# EAGLE design Nano-RS485_RJ45-GW-v1_7 (EAGLE 7.7.0)
Nano-RS485-RFM69_RJ45-GW
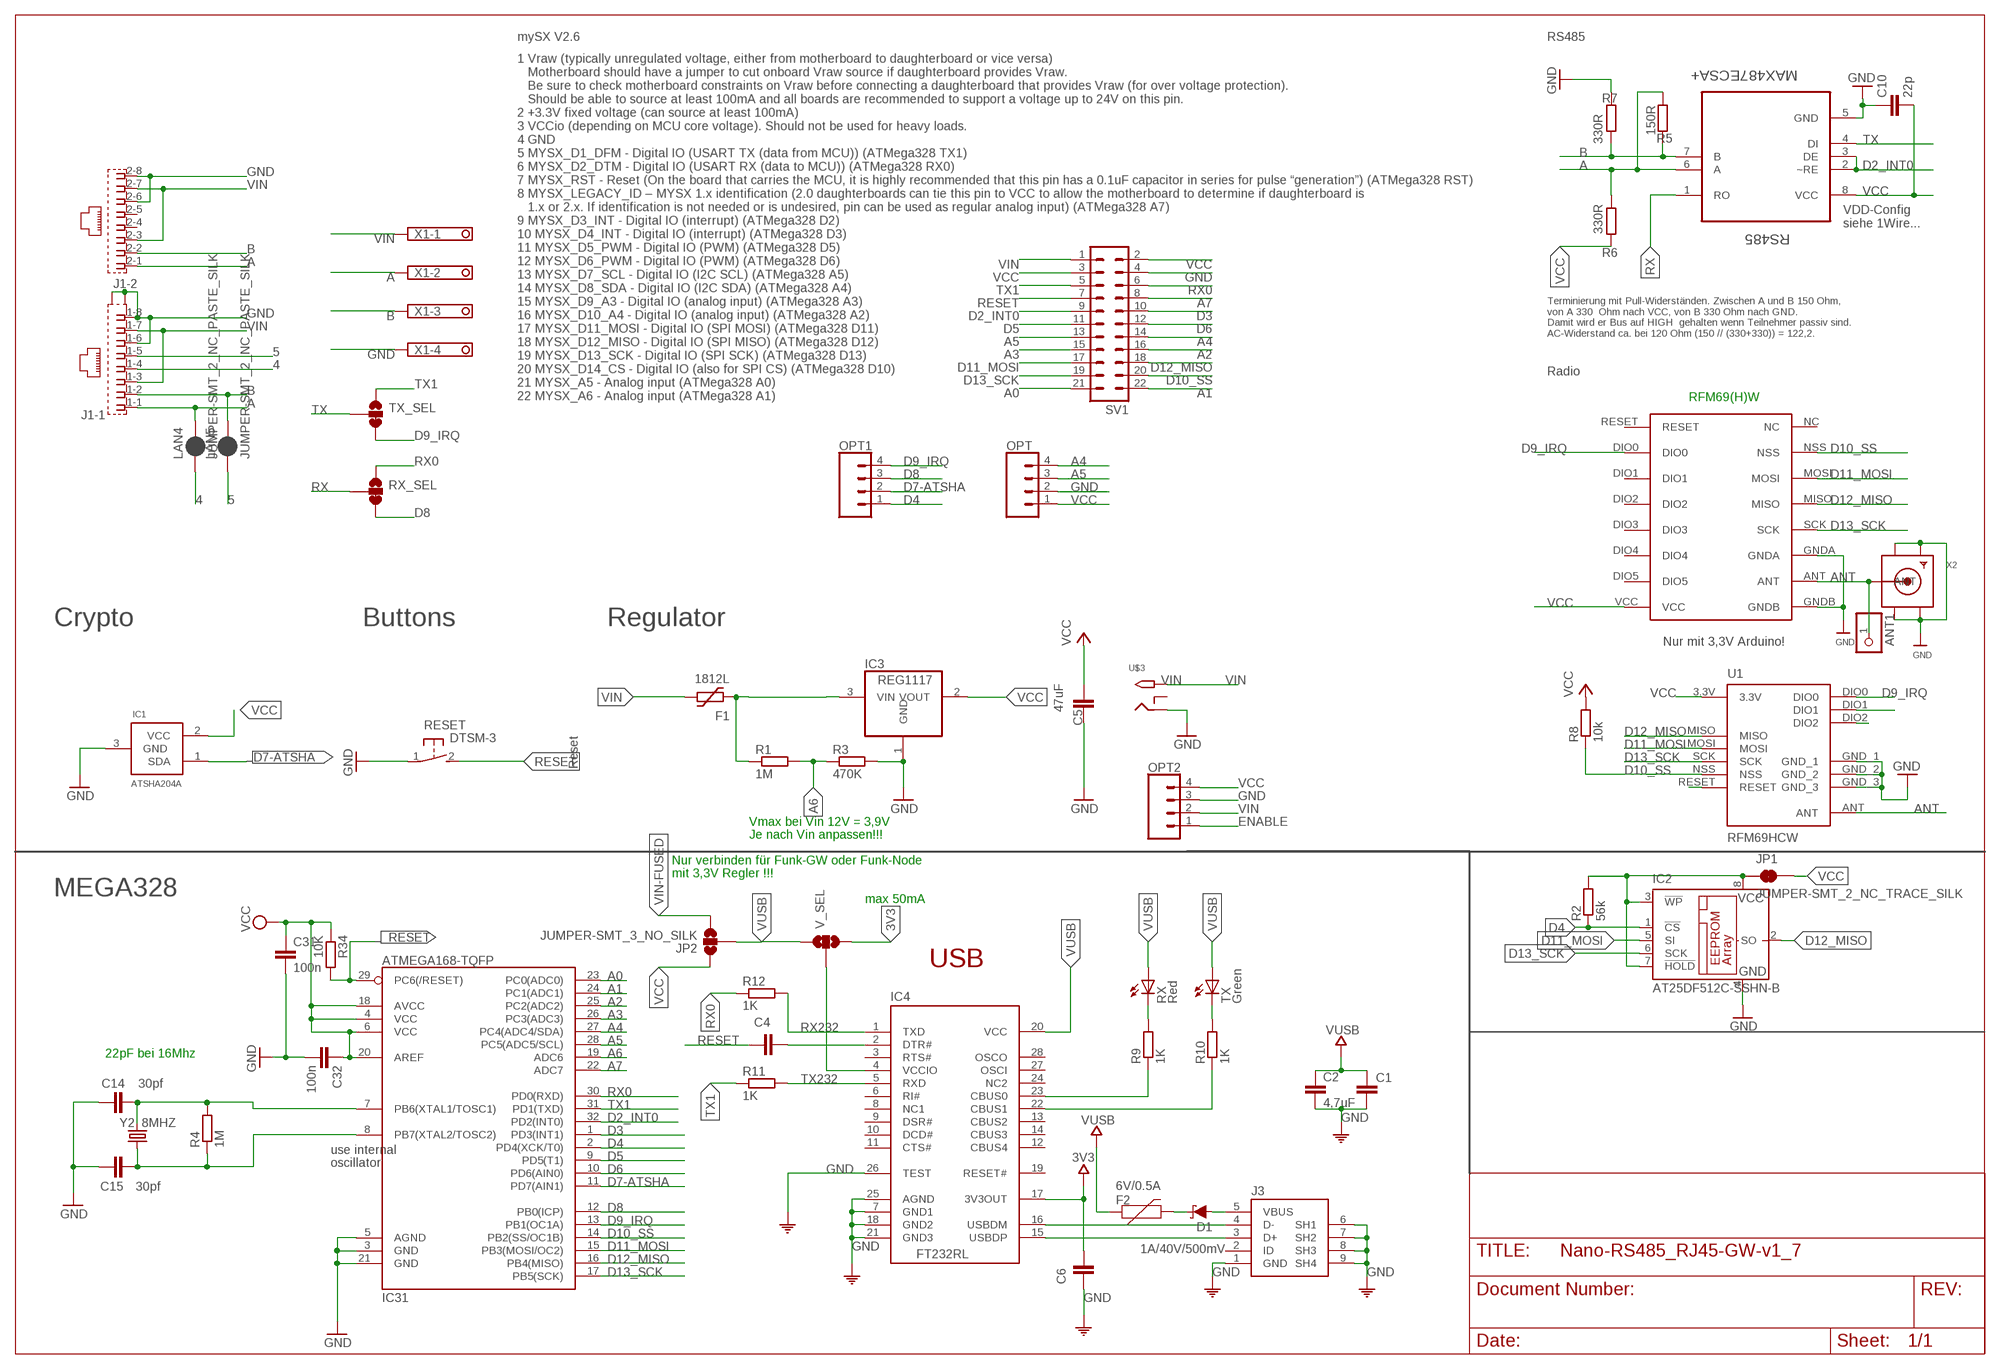
[diagram p0: schematic, sheet 1]

## Parts
ANT1  PINHD-1X1  [1X01]
C1  100nF  C-EUC0805  [C0805]
C2  4,7uF  C-EUC1206  [C1206]
C4  100nF  C-EUC0805  [C0805]
C5  47uF  C-EUC1206  [C1206]
C6  100nF  C-EUC0805  [C0805]
C10  22p  C-EUC0805  [C0805]
C14  30pf  CAP0805  [0805]
C15  30pf  CAP0805  [0805]
C31  100n  C-EUC0805  [C0805]
C32  100n  C-EUC0805  [C0805]
D1  1A/40V/500mV  DIODE-SCHOTTKY-SS14  [SMA-DIODE]
F1  1812L  [1812L]
F2  6V/0.5A  PPTC_HALF-AMP  [1206]
IC1  ATSHA204A  [SOT23]
IC2  AT25DF512C-SSHN-B  25AA080SN  [SO-08]
IC3  REG1117  [SOT223]
IC4  FT232RL  0226_FT232RL  [SSOP28]
IC31  ATMEGA168-TQFP  [TQFP32-08]
J1  RJ45_2X_NARROW_SHILDPINS_NOCASE  [RJ45_2X_NARROW_SHILDPINS_NOCASE]
J3  0219_14850  [USB-MINI-B_2]
JP1  JUMPER-SMT_2_NC_TRACE_SILK  [SMT-JUMPER_2_NC_TRACE_SILK]
JP2  JUMPER-SMT_3_NO_SILK  [SMT-JUMPER_3_NO_SILK]
LAN4  JUMPER-SMT_2_NC_PASTE_SILK  [SMT-JUMPER_2_NC_PASTE_SILK]
LAN5  JUMPER-SMT_2_NC_PASTE_SILK  [SMT-JUMPER_2_NC_PASTE_SILK]
OPT  CONN_04  [1X04]
OPT1  CONN_04  [1X04]
OPT2  CONN_04  [1X04]
R1  1M  R-EU_M0805  [M0805]
R2  56k  R-EU_M0805  [M0805]
R3  470K  R-EU_R0805  [R0805]
R4  1M  R-EU_M0805  [M0805]
R5  150R  R-EU_R0805  [R0805]
R6  330R  R-EU_R0805  [R0805]
R7  330R  R-EU_R0805  [R0805]
R8  10k  R-EU_M0805  [M0805]
R9  1K  R-EU_R0805  [R0805]
R10  1K  R-EU_R0805  [R0805]
R11  1K  R-EU_R0805  [R0805]
R12  1K  R-EU_R0805  [R0805]
R34  10K  R-EU_R0805  [R0805]
RESET  DTSM-3  [DTSM-3]
RFM69W  RFM69HW  [RFM]
RS485  MAX487ECSA+  [SOIC127P600X175-8N]
RX  Red  0181_KTP-2012SURCK  [CHIPLED_0805]
RX_SEL  JUMPER-SMT_3_1-NC_TRACE_SILK  [SMT-JUMPER_3_1-NC_TRACE_SILK]
SV1  MA11-2  [MA11-2]
TX  Green  0043_KPT-2012SGC  [CHIPLED_0805]
TX_SEL  JUMPER-SMT_3_1-NC_TRACE_SILK  [SMT-JUMPER_3_1-NC_TRACE_SILK]
U1  RFM69HCW  [RFM69HCW-XXXS2]
U$3  2.1MMJACKTHM  [PJ-102A]
V_SEL  JUMPER-SMT_3_NO_SILK  [SMT-JUMPER_3_NO_SILK]
X1  1751264  [1751264]
X2  SMACONNECTOR_EDGE  [SMA_EDGELAUNCH]
Y2  8MHZ  CRYSTALTXC-7A  [CRYSTAL-TXC-7A]

## Nets
3V3 [PWR]: C6.2 IC4.17(3V3OUT) V_SEL.3
4: J1.1-4 LAN4.1
5: J1.1-5 LAN5.1
A: J1.1-1 J1.2-1 LAN4.2 R5.1 R6.2 RS485.6(A) X1.2
A0: IC31.23(PC0(ADC0)) SV1.21
A1: IC31.24(PC1(ADC1)) SV1.22
A2: IC31.25(PC2(ADC2)) SV1.16
A3: IC31.26(PC3(ADC3)) SV1.15
A4: IC31.27(PC4(ADC4/SDA)) OPT.4 SV1.14
A5: IC31.28(PC5(ADC5/SCL)) OPT.3 SV1.13
A6: IC31.19(ADC6) R1.2 R3.1
A7: IC31.22(ADC7) SV1.8
ANT: ANT1.1 RFM69W.ANT U1.ANT X2.P(ANT)
B: J1.1-2 J1.2-2 LAN5.2 R5.2 R7.1 RS485.7(B) X1.3
D2_INT0: IC31.32(PD2(INT0)) RS485.2(~RE) RS485.3(DE) SV1.9
D3: IC31.1(PD3(INT1)) SV1.10
D4: IC2.1(!CS) IC31.2(PD4(XCK/T0)) OPT1.1 R2.1
D5: IC31.9(PD5(T1)) SV1.11
D6: IC31.10(PD6(AIN0)) SV1.12
D7-ATSHA: IC1.1(SDA) IC31.11(PD7(AIN1)) OPT1.2
D8: IC31.12(PB0(ICP)) OPT1.3 RX_SEL.3
D9_IRQ: IC31.13(PB1(OC1A)) OPT1.4 RFM69W.DIO0 TX_SEL.3 U1.DIO0
D10_SS: IC31.14(PB2(SS/OC1B)) R8.1 RFM69W.NSS SV1.20 U1.NSS
D11_MOSI: IC2.5(SI) IC31.15(PB3(MOSI/OC2)) RFM69W.MOSI SV1.17 U1.MOSI
D12_MISO: IC2.2(SO) IC31.16(PB4(MISO)) RFM69W.MISO SV1.18 U1.MISO
D13_SCK: IC2.6(SCK) IC31.17(PB5(SCK)) RFM69W.SCK SV1.19 U1.SCK
ENABLE: OPT2.1
GND [PWR]: C1.2 C2.2 C5.1 C6.1 C10.1 C14.1 C15.1 C31.2 C32.2 IC1.3(GND) IC2.4(GND) IC3.1(GND) IC4.7(GND1) IC4.18(GND2) IC4.21(GND3) IC4.25(AGND) IC4.26(TEST) IC31.3(GND) IC31.5(AGND) IC31.21(GND) J1.1-6 J1.1-8 J1.2-6 J1.2-8 J1.G1(-1:S1) J1.G3(-1:S2) J3.1(GND) J3.6(SH1) J3.7(SH2) J3.8(SH3) J3.9(SH4) OPT2.3 OPT.2 R3.2 R7.2 RESET.1 RFM69W.GNDA RFM69W.GNDB RS485.5(GND) SV1.4 U1.GND_1 U1.GND_2 U1.GND_3 U$3.RING X1.4 X2.GND@1(GND4) X2.GND@2(GND3) X2.GND@3(GND2) X2.GND@4(GND1) ; supply symbol labelled COM
N$1: IC4.4(VCCIO) V_SEL.2
N$2: IC4.22(CBUS1) R10.1
N$3: C14.2 IC31.7(PB6(XTAL1/TOSC1)) R4.2 Y2.P$2
N$4: C4.2 IC4.2(DTR#)
N$5: IC4.15(USBDP) J3.3(D+)
N$6: IC4.16(USBDM) J3.4(D-)
N$7: R9.2 RX.C
N$8: IC4.23(CBUS0) R9.1
N$9: R10.2 TX.C
N$12: U1.DIO2
N$13: U1.RESET
N$15: U1.DIO1
N$19: C15.2 IC31.8(PB7(XTAL2/TOSC2)) R4.1 Y2.P$1
RESET: C4.1 IC31.29(PC6(/RESET)) R34.2 RESET.2 SV1.7
RX: RS485.1(RO) RX_SEL.2
RX0: IC31.30(PD0(RXD)) R12.1 RX_SEL.1 SV1.6
RX232: IC4.1(TXD) R12.2
TX: RS485.4(DI) TX_SEL.2
TX1: IC31.31(PD1(TXD)) R11.1 SV1.5 TX_SEL.1
TX232: IC4.5(RXD) R11.2
VCC [PWR]: C5.2 C10.2 C31.1 C32.1 IC1.2(VCC) IC3.2(VOUT) IC31.4(VCC) IC31.6(VCC) IC31.18(AVCC) IC31.20(AREF) JP1.2 JP2.1 OPT2.4 OPT.1 R6.1 R8.2 R34.1 RFM69W.VCC RS485.8(VCC) SV1.2 SV1.3 U1.3.3V
VCC1 [PWR]: IC2.3(!WP) IC2.7(!HOLD) IC2.8(VCC) JP1.1 R2.2
VIN [PWR]: F1.P$2 J1.1-3 J1.1-7 J1.2-3 J1.2-7 OPT2.2 SV1.1 U$3.TIP X1.1
VIN-FUSED [PWR]: F1.P$1 IC3.3(VIN) JP2.3 R1.1
VUSB [PWR]: C1.1 C2.1 F2.1 IC4.20(VCC) JP2.2 RX.A TX.A V_SEL.1
VUSB_PREFUSE [PWR]: D1.C F2.2
VUSB_RAW [PWR]: D1.A J3.5(VBUS)
Unconnected: IC4.3(RTS#) IC4.6(RI#) IC4.8(NC1) IC4.9(DSR#) IC4.10(DCD#) IC4.11(CTS#) IC4.12(CBUS4) IC4.13(CBUS2) IC4.14(CBUS3) IC4.19(RESET#) IC4.24(NC2) IC4.27(OSCI) IC4.28(OSCO) J1.2-4 J1.2-5 J3.2(ID) RFM69W.DIO1 RFM69W.DIO2 RFM69W.DIO3 RFM69W.DIO4 RFM69W.DIO5 RFM69W.NC RFM69W.RESET U$3.RING_SW

## Notes on the sheet
- mySX V2.6 | RS485
- VDD-Config
  siehe 1Wire...
- Terminierung mit Pull-Widerständen. Zwischen A und B 150 Ohm,
  von A 330  Ohm nach VCC, von B 330 Ohm nach GND. 
  Damit wird er Bus auf HIGH  gehalten wenn Teilnehmer passiv sind.
  AC-Widerstand ca. bei 120 Ohm (150 // (330+330)) = 122,2.
- Radio
- RFM69(H)W
- 1 Vraw (typically unregulated voltage, either from motherboard to daughterboard or vice versa)
     Motherboard should have a jumper to cut onboard Vraw source if daughterboard provides Vraw. 
     Be sure to check motherboard constraints on Vraw before connecting a daughterboard that provides Vraw (for over voltage protection). 
     Should be able to source at least 100mA and all boards are recommended to support a voltage up to 24V on this pin.
  2 +3.3V fixed voltage (can source at least 100mA)
  3 VCCio (depending on MCU core voltage). Should not be used for heavy loads.
  4 GND
  5 MYSX_D1_DFM - Digital IO (USART TX (data from MCU)) (ATMega328 TX1)
  6 MYSX_D2_DTM - Digital IO (USART RX (data to MCU)) (ATMega328 RX0)
  7 MYSX_RST - Reset (On the board that carries the MCU, it is highly recommended that this pin has a 0.1uF capacitor in series for pulse “generation”) (ATMega328 RST)
  8 MYSX_LEGACY_ID – MYSX 1.x identification (2.0 daughterboards can tie this pin to VCC to allow the motherboard to determine if daughterboard is 
     1.x or 2.x. If identification is not needed or is undesired, pin can be used as regular analog input) (ATMega328 A7)
  9 MYSX_D3_INT - Digital IO (interrupt) (ATMega328 D2)
  10 MYSX_D4_INT - Digital IO (interrupt) (ATMega328 D3)
  11 MYSX_D5_PWM - Digital IO (PWM) (ATMega328 D5)
  12 MYSX_D6_PWM - Digital IO (PWM) (ATMega328 D6)
  13 MYSX_D7_SCL - Digital IO (I2C SCL) (ATMega328 A5)
  14 MYSX_D8_SDA - Digital IO (I2C SDA) (ATMega328 A4)
  15 MYSX_D9_A3 - Digital IO (analog input) (ATMega328 A3)
  16 MYSX_D10_A4 - Digital IO (analog input) (ATMega328 A2)
  17 MYSX_D11_MOSI - Digital IO (SPI MOSI) (ATMega328 D11)
  18 MYSX_D12_MISO - Digital IO (SPI MISO) (ATMega328 D12)
  19 MYSX_D13_SCK - Digital IO (SPI SCK) (ATMega328 D13)
  20 MYSX_D14_CS - Digital IO (also for SPI CS) (ATMega328 D10)
  21 MYSX_A5 - Analog input (ATMega328 A0)
  22 MYSX_A6 - Analog input (ATMega328 A1)
- Crypto | Buttons | Regulator
- Nur mit 3,3V Arduino!
- Reset
- Vmax bei Vin 12V = 3,9V
- Je nach Vin anpassen!!!
- Nur verbinden für Funk-GW oder Funk-Node
- mit 3,3V Regler !!!
- MEGA328
- max 50mA
- USB
- 22pF bei 16Mhz
- use internal
- oscillator

## Library data of the parts
ANT1 = pinhead:PINHD-1X1: PIN HEADER
C1 C2 C4-C6 = resistor@1:C-EU: CAPACITOR, European symbol
C10 C31 C32 = rcl:C-EU: CAPACITOR, European symbol; SPICEPREFIX: C
C14 C15 = doug:CAP: Capacitor Standard 0603 ceramic capacitor, and 0.1" leaded capacitor.
D1 = SparkFun-DiscreteSemi:DIODE-SCHOTTKY: Schottky diode A Schottky diode is a semiconductor diode which has a low forward voltage drop and a very fast switching action.; PROD_ID: DIO-08053
F1 = ptc-littlefuse:1812L
F2 = SparkFun-Fuses:PPTC: Resettable Fuse PPTC Resettable Fuse. Really a sort of resistor with a polymeric positive temperature coefficient whose resistance increases dramatically with an increase in temperature. When heated by the power passing through the resistance rises causing the current to be limited, protecting the circuit. This is achieved by the transition of the polymer from a crystalline to an amorphous state where the conductive carbon separates breaking the conductive pathways found in the cool crystalline structure. When a PPTC cools back down it resumes conducting letting the circuit turn back on. SparkFun Products: SparkFun RedBoard - Programmed with Arduino <https://www.sparkfun.com/products/12757> Pro Micro - 5V/16MHz <https://www.sparkfun.com/products/12640> Arduino Pro 328 - 5V/16MHz <https://www.sparkfun.com/products/10915> MP3 Trigger <https://www.sparkfun.com/products/13720>; PROD_ID: RES-08585
IC1 = Sensor:ATSHA204A
IC2 = microchip:25*: Serial EEPROM 4K/ 8K , SPI bus; MF: MICROCHIP; MPN: 25AA080/SN; OC_FARNELL: 1816072; OC_NEWARK: 92C7351
IC3 = burr-brown:REG1117: 800mA and 1A Low Dropout (LDO) Positive Regulator 1.8V, 2.5V, 2.85V, 3.3V, 5V, and Adj; MPN: REG1117; OC_FARNELL: 1097566; OC_NEWARK: 14P6981
IC4 = IntegratedCircuits:0226_FT232RL: USB to serial UART interface -FT232RL; CASE: SSOP28; MONTHLY_USAGE: _____; PART_NUMBER: FT232RL; PRICE: _____; SUPPLIER: _____; TYPE: Circuito_Integrato
IC31 = atmel:ATMEGA168: Atmel Atmega 168/328/328P
J1 = RJ45:RJ45_2X_NARROW_SHILDPINS_NOCASE: RJ45 connector
J3 = Connettori:0219_14850: Usb-Mini F 90 Smd; MONTHLY_USAGE: _____; PART_NUMBER: 14850; PRICE: _____; SUPPLIER: _____; TYPE: Connettori; VALUE: USB-mini-90 -SMD
JP1 = SparkFun-Jumpers:JUMPER-SMT_2_NC_TRACE: Normally closed trace jumper This jumper has a trace between two pads so it's normally closed (NC). Use a razor knife to open the connection. For best results follow the IPC guidelines for cutting traces: Cutout at least 0.063 mm (0.005 in). Remove all loose material to clean up the cut area. Seal the cut with an approved epoxy. Reapply solder to reclose the connection.
JP2 V_SEL = SparkFun-Jumpers:JUMPER-SMT_3_NO: Normally open jumper This jumper has three pads in close proximity to each other. Apply solder to close the connection(s).
LAN4 LAN5 = SparkFun-Jumpers:JUMPER-SMT_2_NC_PASTE: Normally closed solder jumper This jumper has an aperture in the stencil to allow solder paste to bridge the split in the wire so it's normally closed (NC). Wick off the solder to open the connection. Reapply solder to reclose the connection.
OPT OPT1 OPT2 = SparkFun-Connectors:CONN_04: Multi connection point. Often used as Generic Header-pin footprint for 0.1 inch spaced/style header connections On any of the 0.1 inch spaced packages, you can populate with these: Break Away Headers - Straight <https://www.sparkfun.com/products/116> (PRT-00116) Break Away Male Headers - Right Angle <https://www.sparkfun.com/products/553> (PRT-00553) Female Headers <https://www.sparkfun.com/products/115> (PRT-00115) Break Away Headers - Machine Pin <https://www.sparkfun.com/products/117> (PRT-00117) Break Away Female Headers - Swiss Machine Pin <https://www.sparkfun.com/products/743> (PRT-00743) For SCREWTERMINALS and SPRING TERMINALS visit here: Screw Terimnals on SparkFun.com <https://www.sparkfun.com/search/results?term=Screw+Terminals> (5mm/3.5mm/2.54mm spacing) This device is also useful as a general connection point to wire up your design to another part of your project. Our various solder wires solder well into these plated through hole pads. Hook-Up Wire - Assortment (Stranded, 22 AWG) <https://www.sparkfun.com/products/11375> (PRT-11375) Hook-Up Wire - Assortment (Solid Core, 22 AWG) <https://www.sparkfun.com/products/11367> (PRT-11367) View the entire wire category on our website here <https://www.sparkfun.com/categories/141> Special notes: Molex polarized connector foot print use with SKU : PRT-08231 with associated crimp pins and housings. 1MM SMD Version SKU: PRT-10208; PROD_ID: CONN-09696
R1 R3-R8 R34 = rcl:R-EU_: RESISTOR, European symbol; SPICEPREFIX: R
R2 = resistor:R-EU_: RESISTOR, European symbol
R9-R12 = resistor@1:R-EU_: RESISTOR, European symbol
RESET = mechanics:DTSM-3: Diptronics SMD button 6x3.5 mm
RFM69W = hoperf:RFM69HW
RS485 = Maxim_By_element14_Batch_1:MAX487ECSA+: Low-Power, Slew-Rate-Limited RS-485/RS-422 Transceivers; MPN: MAX487ECSA+; OC_FARNELL: 9724532; OC_NEWARK: 68K4803; PACKAGE: SOIC-8; SUPPLIER: Maxim
RX = Opto:0181_KTP-2012SURCK: LED RED - SMD - 0805; MONTHLY_USAGE: _____; PART_NUMBER: KTP-2012SURCK; PRICE: _____; SUPPLIER: _____; TYPE: Opto
RX_SEL TX_SEL = SparkFun-Jumpers:JUMPER-SMT_3_1-NC_TRACE: Normally closed trace jumper (1 of 2 connections) This jumper has a trace between two pads so it's normally closed (NC). The other connection is normally open (NO). Use a razor knife to open the connection. For best results follow the IPC guidelines for cutting traces: Cutout at least 0.063 mm (0.005 in). Remove all loose material to clean up the cut area. Seal the cut with an approved epoxy. Reapply solder to reclose the connection, or to close the NO connection.
SV1 = con-Pinheader:MA11-2: PIN HEADER; OC_FARNELL: unknown; OC_NEWARK: unknown
TX = Opto:0043_KPT-2012SGC: LED GREEN - SMD-0805; MONTHLY_USAGE: _____; PART_NUMBER: KPT-2012SGC; PRICE: _____; SUPPLIER: _____; TYPE: Opto
U1 = doug:RFM69H
U$3 = adafruit:2.1MMJACK: 2.1mm x 5.5mm THM DC jack with internal switch. Digikey part #PJ-102A, 4UCON part #05537 2.1mm x 5.5mm SMT DC jack with internal switch. Digikey part #PJ-002A-SMT, 4UCON part #03267 By microbuilder.eu & adafruit.com
X1 = con-phoenix-350:1751264: MKDS 1/ 4-3,5 Printklemme Nennstrom: 10 A Bemessungsspannung: 160 V Raster: 3,5 mm Polzahl: 4 Montageart: Löten Anschlussart: Schraubanschluss Anschlussrichtung vom Leiter zur Platine: 0° Source: http://eshop.phoenixcontact.com .. 1751264.pdf; MPN: 1751264; OC_FARNELL: unknown; OC_NEWARK: 10R0934
X2 = adafruit:SMACONNECTOR: SMA Connector 90° DIP SMA Connector, 50 Ohm (4UConnector: 07259)
Y2 = SparkFun-FreqCtrl:CRYSTAL: Various standard crystals. Proven footprints.

## Net classes
0 default: width 0.254 mm
1 PWR: width 0.406 mm

## Board
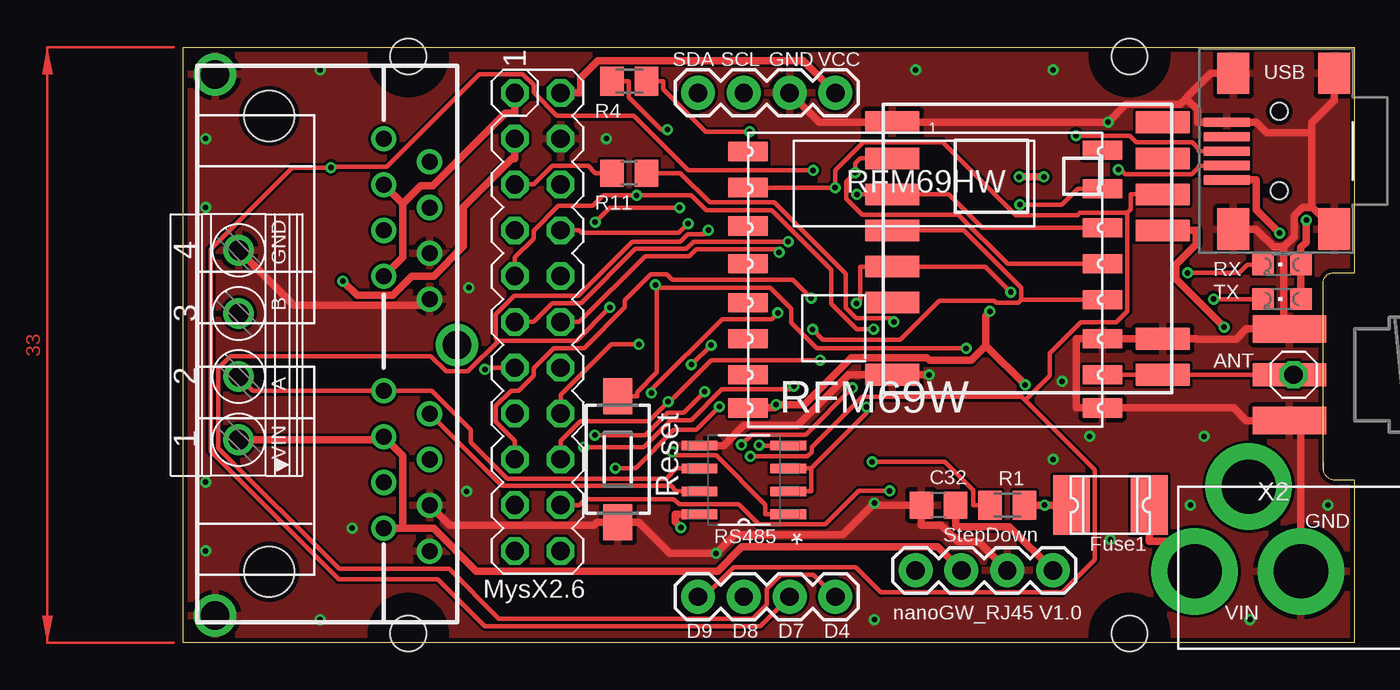
[diagram p1: board, top side]
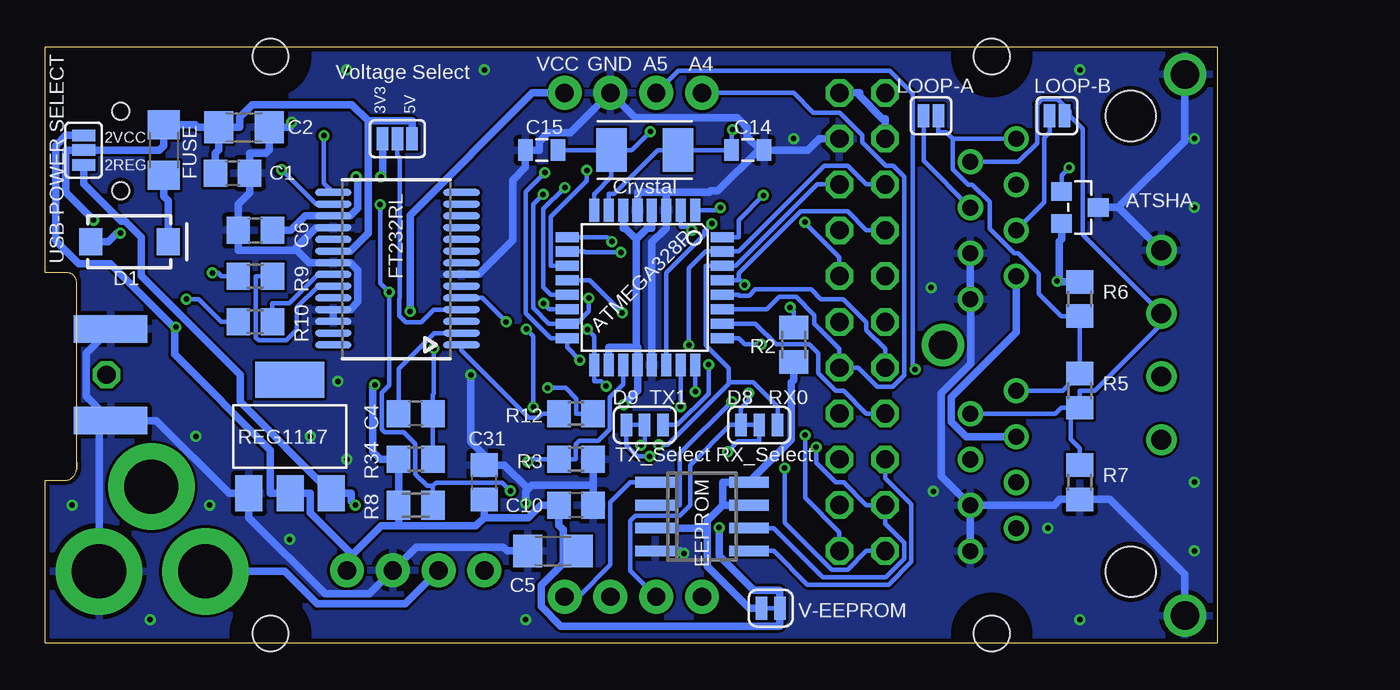
[diagram p2: board, bottom side, seen from below]

Size 65 x 33 mm. Coordinates in mm from the lower left corner, seen from the top.
Outline: 63.25,9.6 arc90 64,9 65,9 65,0 0,0 0,33 65,33 65,20.5 63.8,20.5 arc90 63.25,20 63.25,9.6
Outline: 63.25,9.6 63.25,10 63.25,9.6
Copper layers (1*16): Top 0.035mm / dielectric 1.5mm / Bottom 0.035mm
Design rules "SeeedStudio_2layer_DRU_no_angle_20140221": minimum track width 6mil, minimum drill 12mil, track to track 6mil, track to pad 6mil, pad to pad 6mil, via to via 6mil, smd to smd 0mil, copper to edge 10mil, drill to drill 10mil, minimum pad ring 10mil, minimum via ring 6mil, stop-mask expansion 2mil, vias tented up to drill 100mil, thermal gap 10mil
Holes 2 mm at 52.5,0.5 52.5,32.5 12.5,0.5 12.5,32.5
tRestrict: area 50.3,-1.7 to 54.7,2.7; area 50.3,30.3 to 54.7,34.7; area 10.3,30.3 to 14.7,34.7; area 10.3,-1.7 to 14.7,2.7
bRestrict: area 10.3,-1.7 to 14.7,2.7; area 50.3,-1.7 to 54.7,2.7; area 50.3,30.3 to 54.7,34.7; area 10.3,30.3 to 14.7,34.7

### Footprints (pad centres in the part's own frame; a part is rotated, then mirrored left to right if it is on the bottom)
1X01 = drill 1.016 octagon: 1 0,0
C0805 = smd 1.3 x 1.5: 1 -0.95,0; 2 0.95,0
C1206 = smd 1.6 x 1.8: 1 -1.4,0; 2 1.4,0
0805 = smd 0.8 x 1.2: 1 -0.9,0; 2 0.9,0
SMA-DIODE = smd 1.27 x 1.47: A -2.15,0; C 2.15,0
1812L = smd 2.03 x 3.3: P$1 -2.16,0; P$2 2.16,0
1206 = smd 1.6 x 1.8: 1 -1.4,0; 2 1.4,0
SOT23 = smd 1.016 x 1.143: 1 -0.889,-1.016; 2 0.889,-1.016; 3 0,1.016
SO-08 = smd 0.6 x 2.2: 1 -1.905,-2.6; 2 -0.635,-2.6; 3 0.635,-2.6; 4 1.905,-2.6; 5 1.905,2.6; 6 0.635,2.6; 7 -0.635,2.6; 8 -1.905,2.6
SOT223 = smd 1.499 x 2.007: 1 -2.261,-3.15; 2 0.025,-3.15; 3 2.311,-3.15 | smd 3.81 x 2.007: 4 0,3.15
SSOP28 = smd 0.381 x 2.032: 1 0,0; 2 0.65,0; 3 1.3,0; 4 1.95,0; 5 2.6,0; 6 3.25,0; 7 3.9,0; 8 4.55,0; 9 5.2,0; 10 5.85,0; 11 6.5,0; 12 7.15,0; 13 7.8,0; 14 8.45,0; 15 8.45,7.112; 16 7.8,7.112; 17 7.15,7.112; 18 6.5,7.112; 19 5.85,7.112; 20 5.2,7.112; 21 4.55,7.112; 22 3.9,7.112; 23 3.25,7.112; 24 2.6,7.112; 25 1.95,7.112; 26 1.3,7.112; 27 0.65,7.112; 28 0,7.112
TQFP32-08 = smd 1.27 x 0.559: 1 -4.293,2.8; 2 -4.293,2; 3 -4.293,1.2; 4 -4.293,0.4; 5 -4.293,-0.4; 6 -4.293,-1.2; 7 -4.293,-2; 8 -4.293,-2.8; 17 4.293,-2.8; 18 4.293,-2; 19 4.293,-1.2; 20 4.293,-0.4; 21 4.293,0.4; 22 4.293,1.2; 23 4.293,2; 24 4.293,2.8 | smd 0.559 x 1.27: 9 -2.8,-4.293; 10 -2,-4.293; 11 -1.2,-4.293; 12 -0.4,-4.293; 13 0.4,-4.293; 14 1.2,-4.293; 15 2,-4.293; 16 2.8,-4.293; 25 2.8,4.293; 26 2,4.293; 27 1.2,4.293; 28 0.4,4.293; 29 -0.4,4.293; 30 -1.2,4.293; 31 -2,4.293; 32 -2.8,4.293
RJ45_2X_NARROW_SHILDPINS_NOCASE = drill 0.889: 1-1 -11.43,6.35; 1-2 -10.16,8.89; 1-3 -8.89,6.35; 1-4 -7.62,8.89; 1-5 -6.35,6.35; 1-6 -5.08,8.89; 1-7 -3.81,6.35; 1-8 -2.54,8.89; 2-1 2.54,6.35; 2-2 3.81,8.89; 2-3 5.08,6.35; 2-4 6.35,8.89; 2-5 7.62,6.35; 2-6 8.89,8.89; 2-7 10.16,6.35; 2-8 11.43,8.89 | drill 1.575 pad 2.184: G1 -15,-3; G2 0,10.414; G3 15,-3 | hole 2.8: -12.7,0; 12.573,0
USB-MINI-B_2 = smd 0.508 x 2.54: 1 0,0; 2 0.8,0; 3 1.6,0; 4 2.4,0; 5 3.2,0 | smd 2.286 x 1.778: 6 -2.717,5.948; 7 -2.717,0.36; 8 5.918,0.36; 9 5.918,5.948 | hole 0.95: -0.6,2.9; 3.8,2.9
SMT-JUMPER_2_NC_TRACE_SILK = smd 0.635 x 1.27: 1 -0.508,0; 2 0.508,0
SMT-JUMPER_3_NO_SILK = smd 0.635 x 1.27: 1 -0.813,0; 2 0,0; 3 0.813,0
SMT-JUMPER_2_NC_PASTE_SILK = smd 0.635 x 1.27: 1 -0.406,0; 2 0.406,0
1X04 = drill 1.016 pad 1.88: 1 0,0; 2 2.54,0; 3 5.08,0; 4 7.62,0
M0805 = smd 1.3 x 1.6: 1 -0.95,0; 2 0.95,0
R0805 = smd 1.3 x 1.5: 1 -0.95,0; 2 0.95,0
DTSM-3 = smd 2 x 1.6: 1 -3.494,0; 2 3.494,0
RFM = smd 2.184 x 1.067: ANT 19.651,2.889; DIO0 0,13.27; DIO1 0,11.143; DIO2 0,9.047; DIO3 0,6.889; DIO4 0,4.889; DIO5 0,2.889; GNDA 19.651,4.889; GNDB 19.651,1.048; MISO 19.651,9.047; MOSI 19.651,11.047; NC 19.651,15.334; NSS 19.651,13.206; RESET 0,15.27; SCK 19.651,7.048; VCC 0,1.048
SOIC127P600X175-8N = smd 1.981 x 0.533: 1 -2.464,1.905; 2 -2.464,0.635; 3 -2.464,-0.635; 4 -2.464,-1.905; 5 2.464,-1.905; 6 2.464,-0.635; 7 2.464,0.635; 8 2.464,1.905
CHIPLED_0805 = smd 1.2 x 1.2: A 0,-1.05; C 0,1.05
SMT-JUMPER_3_1-NC_TRACE_SILK = smd 0.635 x 1.27: 1 -1.016,0; 2 0,0; 3 1.016,0
MA11-2 = drill 1.016 octagon: 1 -12.7,-1.27; 2 -12.7,1.27; 3 -10.16,-1.27; 4 -10.16,1.27; 5 -7.62,-1.27; 6 -7.62,1.27; 7 -5.08,-1.27; 8 -5.08,1.27; 9 -2.54,-1.27; 10 -2.54,1.27; 11 0,-1.27; 12 0,1.27; 13 2.54,-1.27; 14 2.54,1.27; 15 5.08,-1.27; 16 5.08,1.27; 17 7.62,-1.27; 18 7.62,1.27; 19 10.16,-1.27; 20 10.16,1.27; 21 12.7,-1.27; 22 12.7,1.27
RFM69HCW-XXXS2 = smd 3 x 1.2: 3.3V 7.5,1; ANT 7.5,-7; DIO0 7.5,3; DIO1 7.5,5; DIO2 7.5,7; GND_1 7.5,-5; GND_2 -7.5,-7; GND_3 -7.5,7; MISO -7.5,5; MOSI -7.5,3; NSS -7.5,-1; RESET -7.5,-3; SCK -7.5,1
PJ-102A = drill 3 pad 4.8: RING 0.1,-3.39; RING_SW -4.6,-6.29; TIP 0.1,-9.29
1751264 = drill 1.1 pad 1.7: 1 -5.25,-0.1; 2 -1.75,-0.1; 3 1.75,-0.1; 4 5.25,-0.1
SMA_EDGELAUNCH = smd 4.064 x 1.524: GND@1 2.032,-2.54; GND@2 2.032,2.54 | smd 4.064 x 1.524 bottom: GND@3 2.032,2.54; GND@4 2.032,-2.54 | smd 4.064 x 1.27: P 2.032,0
CRYSTAL-TXC-7A = smd 1.7 x 2.4: P$1 1.85,0; P$2 -1.85,0

### Placement (x,y rotation side)
ANT1  61.6,14.85 0 top
C1  54.61,26.04 0 bottom
C2  53.98,28.57 0 bottom
C4  44.45,12.7 180 bottom
C5  36.83,5.08 0 bottom
C6  53.34,22.86 0 bottom
C10  35.56,7.62 180 bottom
C14  26.04,27.3 180 bottom
C15  37.47,27.3 0 bottom
C31  40.64,8.89 90 bottom
C32  41.91,7.62 180 top
D1  60.33,22.23 0 bottom
F1  51.44,7.62 0 top
F2  58.42,27.3 270 bottom
IC1  7.62,24.13 270 bottom
IC2  28.57,6.99 270 bottom
IC3  51.44,11.43 0 bottom
IC4  41.91,16.51 90 bottom
IC31  31.75,19.68 270 bottom
J1  4.8,16.5 270 top
J3  57.9,28.85 270 top
JP1  24.77,1.91 0 bottom
JP2  62.87,27.3 270 bottom
LAN4  15.88,29.21 0 bottom
LAN5  8.89,29.21 0 bottom
OPT  36.2,30.48 180 top
OPT1  36.2,2.54 180 top
OPT2  40.64,4 0 top
R1  45.72,7.62 180 top
R2  23.5,16.51 270 bottom
R3  35.56,10.16 0 bottom
R4  24.77,31.11 180 top
R5  7.62,13.97 270 bottom
R6  7.62,19.05 270 bottom
R7  7.62,8.89 270 bottom
R8  44.45,7.62 180 bottom
R9  53.34,20.32 180 bottom
R10  53.34,17.78 180 bottom
R11  24.77,26.04 0 top
R12  35.56,12.7 180 bottom
R34  44.45,10.16 0 bottom
RESET  24.13,10.16 90 top
RFM69W  31.35,11.96 0 top
RS485  31.11,9.02 180 top
RX  60.96,20.95 90 top
RX_SEL  25.4,12.06 180 bottom
SV1  19.68,17.78 270 top
TX  60.96,19.05 90 top
TX_SEL  31.75,12.06 180 bottom
U1  46.85,21.85 0 top
U$3  65.4,4.05 270 top
V_SEL  45.47,27.94 180 bottom
X1  3,16.5 90 top
X2  63.4,14.85 180 top
Y2  31.75,27.3 180 bottom

### Tracks (layer width: path | path; a pad name or v marks a point on that pad's centre or on a via)
3V3  (via drill 0.3 pad 0.61)
  Top 0.406: v47.76,25.82 v46.38,25.82
  Bottom 0.406: V_SEL.3 46.28,25.92 v46.38,25.82 | v47.76,25.82 47.65,25.71 47.65,24.08 48.07,23.66 IC4.17 50.58,23.66 51.38,22.86 C6.2
4
  Bottom 0.254: LAN4.1 16.28,26.71 J1.1-4
5
  Bottom 0.254: J1.1-5 9.59,24.41 9.59,28 9.3,28.3 LAN5.1
A
  Top 0.254: RS485.6 27.38,9.65 26.82,9.09 18,9.09 15.98,11.11 15.98,11.79 13.81,13.96 J1.2-1 3.89,13.96 X1.2
  Bottom 0.254: LAN4.2 15.47,28.3 15.04,28.3 14.67,27.93 | 14.67,27.93 J1.1-1 | 14.67,27.93 14.67,26.25 13.8,25.39 13.57,25.39 12.62,24.44 12.62,22.94 11.26,21.58 11.04,21.58 9.9,20.44 9.9,19.35 8.65,18.1 R6.2 R5.1 8.58,13.96 J1.2-1
A0  (via drill 0.3 pad 0.61)
  Top 0.254: v23.99,9.68 25.13,9.68 27.24,11.79 28.47,11.79 v29.76,13.08
  Bottom 0.254: IC31.23 29.75,13.1 v29.76,13.08 | SV1.21 19.46,5.08 20.5,4.03 21.38,4.03 23.99,6.64 v23.99,9.68
A1  (via drill 0.3 pad 0.61)
  Top 0.254: v22.86,11.5 25.66,11.5 26.9,12.74 27.77,12.74 v28.94,13.91
  Bottom 0.254: v28.94,13.91 28.94,14.46 28.95,14.48 IC31.24 | SV1.22 20.95,6.12 22.86,8.03 v22.86,11.5
A2  (via drill 0.3 pad 0.61)
  Top 0.254: v25.29,16.54 23.75,16.54 20.95,13.74 SV1.16
  Bottom 0.254: v25.29,16.54 26.2,16.54 26.54,16.89 IC31.25
A3
  Bottom 0.254: SV1.15 19.46,12.7 20.73,13.97 21.17,13.97 22.12,14.93 22.12,16.04 22.61,16.53 24.45,16.53 25.61,17.68 IC31.26
A4
  Bottom 0.254: IC31.27 24.97,18.48 24.29,19.17 23.36,19.17 22.35,18.16 22.35,17.68 20.95,16.28 SV1.14 19.91,15.24 18.87,14.2 17.98,14.2 17.37,14.81 17.37,25.84 17.98,26.45 18.4,26.45 19.68,27.73 19.68,28.14 20.93,29.39 22.4,29.39 23.49,30.48 OPT.4
A5  (via drill 0.3 pad 0.61)
  Top 0.254: SV1.13 16.85,15.24 v16.75,15.15
  Bottom 0.254: IC31.28 26.54,19.29 26.5,19.24 25.96,19.24 25.63,19.58 22.53,19.58 22,19.05 20.75,19.05 19.46,17.76 19.46,17.32 18.41,16.28 SV1.13 | v16.75,15.15 16.88,15.27 16.88,30.42 18.16,31.7 29.89,31.7 OPT.3
A6  (via drill 0.3 pad 0.61)
  Top 0.254: v38.23,10.02 42.26,10.02 43.84,8.44 43.84,7.62 R1.2
  Bottom 0.254: IC31.19 32.95,14.33 33.68,13.6 33.68,11.83 34.32,11.19 35.38,11.19 35.58,10.99 35.58,10.16 R3.1 36.98,10.16 37.44,10.16 38.09,10.16 v38.23,10.02
A7  (via drill 0.3 pad 0.61)
  Top 0.254: v28.02,23.23 27.52,22.73 22.13,22.73 22,22.86 SV1.8
  Bottom 0.254: v28.02,23.23 28.44,22.81 28.44,22.62 30.55,20.52 IC31.22
ANT
  Top 0.254: ANT1.1 X2.P U1.ANT 52.37,14.85 RFM69W.ANT
B
  Top 0.254: J1.2-2 17.7,8.69 27.08,8.69 27.38,8.38 RS485.7
  Bottom 0.254: 8.19,29.21 7.46,28.48 7.46,22.61 X1.3 3.1,17.64 6.79,13.95 7.62,13.95 R5.2 8.13,13.02 | 8.19,29.21 8.19,29.45 8.86,30.12 9.73,30.12 9.99,29.86 9.99,27.7 11.03,26.66 J1.1-2 | LAN5.2 8.19,29.21 | J1.2-2 8.98,12.69 8.65,13.02 8.13,13.02 | R7.1 7.62,10.77 8.13,11.28 8.13,13.02
D2_INT0  (via drill 0.3 pad 0.61)
  Top 0.254: v38.31,17.39 37.37,17.39 35.96,18.79 35.96,20.68 32.67,23.97 29.04,23.97 28.21,24.79 v25.17,24.79 23.32,24.79 22.74,24.21 20.83,24.21 19.46,22.84 19.46,22.4 18.41,21.36 SV1.9 | 34.85,9.65 34.21,9.65 RS485.3 | v37.93,13.05 37.93,12.73 34.85,9.65 | 34.85,9.65 34.85,8.38 RS485.2
  Bottom 0.254: v25.17,24.79 26.54,23.41 26.54,22.48 IC31.32 | v37.93,13.05 37.93,17 v38.31,17.39
D3  (via drill 0.3 pad 0.61)
  Top 0.254: v22.88,23.31 23.67,24.11 v27.56,24.11
  Bottom 0.254: IC31.1 27.69,23.98 v27.56,24.11 | SV1.10 20.95,21.36 22.88,23.28 v22.88,23.31
D4  (via drill 0.3 pad 0.61)
  Top 0.254: OPT1.1 34.97,3.76 33.15,3.76 32.38,3 32.38,2.08 31.62,1.32 17.53,1.32 14.77,4.08 8.67,4.08 1.97,10.78 1.97,15.22 2.63,15.88 13.77,15.88 14.61,15.04 15.82,15.04 17.51,16.73 | 17.51,16.73 | 17.51,16.73 17.37,16.88 17.37,18.21 18.39,19.23 21.92,19.23 24.93,22.24 27.6,22.24 28.01,22.64 28.93,22.64 v29.15,22.86 | 17.51,16.73 21.84,16.73 v23.69,18.59
  Bottom 0.254: IC31.2 29.75,23.06 29.35,23.06 v29.15,22.86 | v23.69,18.59 23.5,18.39 R2.1 | OPT1.1 35.42,2.54 33.65,4.31 33.65,7.79 32.55,8.89 IC2.1
D5  (via drill 0.3 pad 0.61)
  Top 0.254: v33.57,22.24 28.33,22.24 27.93,21.83 25.1,21.83 22.09,18.82 20.5,18.82 19.46,17.78 SV1.11
  Bottom 0.254: IC31.9 33.81,22.48 v33.57,22.24
D6  (via drill 0.3 pad 0.61)
  Top 0.254: v33.08,21.63 32.88,21.82 28.49,21.82 28.09,21.43 25.64,21.43 22,17.78 SV1.12
  Bottom 0.254: v33.08,21.63 35.07,21.63 35.13,21.68 IC31.10
D7-ATSHA  (via drill 0.3 pad 0.61)
  Top 0.254: v34.95,26.18 28.03,26.18 25,29.21 20.75,29.21 19.46,30.5 19.46,30.92 18.85,31.53 16.45,31.53 11.31,26.39 8.27,26.39 v8.22,26.33 6.08,26.33 1.55,21.81 1.55,10.62 8.65,3.52 14.14,3.52 16.76,0.91 32.02,0.91 OPT1.2
  Bottom 0.254: IC31.11 36.96,20.89 36.96,23.61 34.95,25.61 v34.95,26.18 | v8.22,26.33 8.64,25.91 IC1.1
D8  (via drill 0.3 pad 0.61)
  Top 0.254: v25.98,13.84 25.98,14.01 29.92,17.94 32.67,17.94 v33,18.27
  Bottom 0.254: v25.98,13.84 25.98,13.41 26.42,12.98 RX_SEL.3 27.01,12.06 29.24,9.84 29.24,7.6 29.8,7.04 32.28,7.04 32.55,6.77 32.55,3.98 OPT1.3 | v33,18.27 34.81,20.09 IC31.12
D9_IRQ  (via drill 0.3 pad 0.61)
  Top 0.254: 52.38,23.83 49.75,23.83 49.62,23.7 46.18,23.7 42.15,27.73 37.73,27.73 36.18,26.18 v36.18,25.23 32.72,25.23 RFM69W.DIO0 | 52.38,23.83 52.57,24.02 52.57,24.85 U1.DIO0 | 52.38,23.83 52.38,18.36 51.78,17.76 49.78,17.76 48.08,16.05 48.08,14.81 46.72,13.45 | 46.72,13.45 50.57,9.59 50.57,4.59 48.77,2.78 38.71,2.78 37.32,4.17 30.57,4.17 28.93,2.54 OPT1.4 | v31.47,10.33 34.64,10.33 34.87,10.56 34.87,10.83 37.69,13.64 46.52,13.64 46.72,13.45
  Bottom 0.254: v31.47,10.33 32.17,10.33 32.77,10.93 TX_SEL.3 | IC31.13 36.96,19.29 37.37,19.7 37.37,24.04 v36.18,25.23
D10_SS  (via drill 0.3 pad 0.61)
  Top 0.254: v45.92,19.43 44.49,20.85 U1.NSS 38.46,20.85 37.57,20.85 37.57,19.02 v37.35,18.8 | v46.42,24.29 48.75,24.29 49.63,25.17 RFM69W.NSS | v39.2,8.41 37.48,8.41 35.63,6.56 31.94,6.56 30.84,7.66 27.53,7.66 27.24,7.95 22.32,7.95 22,7.62 SV1.20
  Bottom 0.254: 43.5,8.68 43.82,8.68 44.47,9.34 44.47,11.03 45.11,11.67 46.17,11.67 46.33,11.83 46.33,13.85 45.92,14.26 v45.92,19.43 46.42,19.93 v46.42,24.29 | 43.5,8.68 43.31,8.87 39.66,8.87 v39.2,8.41 | R8.1 43.5,8.68 | IC31.14 37.04,18.48 v37.35,18.8
D11_MOSI  (via drill 0.3 pad 0.61)
  Top 0.254: RFM69W.MOSI 49.63,23.01 44.33,23.01 42.49,24.85 U1.MOSI 38.46,24.85 37.57,24.85 v37.39,24.85 | v34.85,19.11 33.84,20.12 27.14,20.12 26.85,20.41 25.97,20.41 24.52,18.97 24.52,18.59 22.26,16.33 20.57,16.33 19.46,15.22 19.46,14.8 18.63,13.97 18.21,13.97 17.37,13.13 17.37,12.25 18.41,11.2 SV1.17
  Bottom 0.254: v34.85,19.11 34.85,18.36 35.53,17.68 IC31.15 36.4,17.68 36.96,17.68 37.06,17.68 37.94,18.56 37.94,24.3 v37.39,24.85 | IC2.5 24.6,5.08 22.73,3.21 18.22,3.21 16.96,4.47 16.96,7.67 18.41,9.12 SV1.17
D12_MISO  (via drill 0.3 pad 0.61)
  Top 0.254: v35.34,15.66 29.3,15.66 27,13.36 v26.92,13.36 25.84,12.28 22.03,12.28 20.95,11.2 SV1.18 | RFM69W.MISO 45.74,21.01 43.02,23.73 37.68,23.73 36.8,24.61 36.8,25.56 v37.29,26.05 37.29,26.57 37.57,26.85 U1.MISO
  Bottom 0.254: v35.34,15.66 36.04,16.36 IC31.16 36.96,16.89 38.34,18.27 38.34,25 v37.29,26.05 | IC2.2 29.8,7.62 29.8,10.49 v26.92,13.36
D13_SCK  (via drill 0.3 pad 0.61)
  Top 0.254: 46.5,19.01 46.34,18.84 45.1,18.84 45.01,18.94 41.94,18.94 39.79,16.8 35.5,16.8 v34.94,17.37 | 46.5,19.01 49.63,19.01 RFM69W.SCK | 46.5,19.01 46.5,19.67 43.32,22.85 U1.SCK | v22.24,10.84 25.57,10.84 27.07,12.34 28.19,12.34 29.89,14.04 33.71,14.04 v33.89,14.22
  Bottom 0.254: v22.24,10.84 22.24,9.96 21.17,8.89 20.73,8.89 19.46,7.62 SV1.19 18.41,6.58 17.37,5.54 17.37,4.65 18.39,3.63 21.87,3.63 24.6,6.35 IC2.6 | v33.89,14.22 34.15,14.48 34.55,14.48 IC31.17 34.55,15.85 34.55,16.31 34.55,16.98 v34.94,17.37
GND  (via drill 0.3 pad 0.61)
  Top 0.406: v41.39,14.85 41.21,14.85 U1.GND_2 37.49,14.85 36.92,14.85 34.11,12.04 31.12,12.04 30,10.92 RS485.5 | U$3.RING 62.01,11.67 X2.GND@2 58.98,12.31 58.28,13.01 52.45,13.01 51.37,13.01 RFM69W.GNDB 49.55,13.01 49.55,16.85 RFM69W.GNDA 52.45,16.85 U1.GND_1 56.21,16.85 56.22,16.83 58.42,16.83 58.98,17.39 61.14,17.39 | 55.65,30.16 56.27,29.53 56.27,28.85 J3.1 59.53,28.85 60.11,28.26 62.6,28.26 | 55.65,30.16 55.33,29.84 52.3,29.84 v51.31,28.86 41.21,28.86 41.21,28.85 U1.GND_3 35.28,28.85 OPT.2 | 55.65,30.16 55.65,30.2 57.02,31.57 J3.7 | 62.6,28.26 62.6,24.14 | 62.6,28.26 62.6,28.82 63.85,30.07 J3.6 | J3.8 59.51,22.93 60.5,21.94 61.05,21.94 | 62.6,24.14 62.63,24.14 J3.9 | 61.05,21.94 61.62,22.51 61.62,23.67 62.09,24.14 62.6,24.14 | 61.14,17.39 61.05,17.48 61.05,21.94 | X2.GND@1 61.14,17.39 | OPT2.3 44.14,5.58 42.99,5.58 42.06,6.51 40.96,6.51 C32.2 39.95,7.62 38.46,7.62 v38.35,7.73 36.61,5.98 30.61,5.98 v29.58,4.95 27,4.95 25.29,6.67 RESET.1 22.97,6.67 22.8,6.5 14.8,6.5 J1.2-6 | X1.4 6.15,18.7 13.35,18.7 J1.1-8
  Bottom 0.406: 40.09,9.84 41.39,11.14 v41.39,14.85 | 51.04,21.75 50.34,21.06 IC4.21 48.08,21.06 47.65,20.63 47.65,18.89 48.08,18.46 IC4.25 IC4.26 | 40.09,9.84 39.53,9.84 38.22,8.53 | C31.2 40.09,9.84 | 51.04,21.75 54.29,21.75 C6.1 54.29,24.3 53.66,24.93 C1.2 53.66,27.14 52.75,27.14 52.58,27.32 C2.2 51.42,28.57 51.42,28.75 v51.31,28.86 | 51.04,21.75 51.04,21.94 49.97,23.01 IC4.18 | X2.GND@2 58.83,12.31 54.8,8.28 IC3.1 53.7,6.92 49.48,2.7 47.02,2.7 OPT2.3 44.42,5.29 39.6,5.29 39.39,5.08 C5.1 | X2.GND@1 62.72,16.04 62.72,13.66 X2.GND@2 | J1.1-6 J1.1-8 13.68,19.03 13.68,15.47 15.31,13.84 15.31,9.23 J1.2-6 | J1.2-6 9.06,7.61 8.73,7.94 R7.2 5.97,7.94 1.8,3.77 J1.G3 | 34.61,8.73 34.61,9.05 R3.2 | 38.22,8.53 38.02,8.73 34.61,8.73 | v38.35,7.73 38.35,8.39 38.22,8.53 | 30.55,24.97 28.18,24.97 28.1,25.05 27.69,25.05 25.39,27.35 | v29.58,4.95 29.71,5.08 29.72,5.08 IC2.4 | C10.1 34.61,8.73 | IC31.5 32.15,24.97 30.55,24.97 | 25.39,27.35 25.34,27.3 25.17,27.3 C14.1 24.38,27.3 22.71,27.3 22.07,27.94 SV1.4 | 25.39,27.35 26.06,28.03 26.06,28.56 26.61,29.11 32.28,29.11 OPT.2 35.87,28.26 37.11,28.26 37.61,27.77 37.61,27.3 C15.1 38.37,26.35 39.07,25.65 39.07,22.31 40.96,20.41 IC4.7 | 30.55,24.97 IC31.3 30.55,22.99 31.35,22.19 IC31.21 | X2.GND@2 62.01,11.67 U$3.RING | 5.48,24.13 IC1.3 | X1.4 5.48,24.13 | 5.48,24.13 1.8,27.81 J1.G1 | J1.2-8 J1.2-6
  other vias: 1.27,27.94 1.27,24.13 1.27,8.89 1.27,5.08 7.62,31.75 7.62,1.27 40.64,31.75 48.26,31.75 48.77,14.48 50.29,11.43 56.64,11.43 59.18,1.27 63.5,7.62 38.35,1.27 9.4,6.35 15.75,8.38 15.88,19.68 23.5,27.94 51.44,5.71 48.26,10.16 55.88,7.62
  pour Top: 0,0 0,33.02 64.77,33.02 64.77,0
  pour Bottom: 0,0 0,33.02 64.77,33.02 64.77,0
N$1
  Bottom 0.254: V_SEL.2 45.47,27.03 45.33,26.89 45.33,19.1 45.35,19.09 45.35,18.11 45,17.77 44.14,17.77 43.45,18.46 IC4.4
N$2
  Bottom 0.254: R10.1 52.39,18.81 51.47,18.81 49.87,20.41 IC4.22
N$3  (via drill 0.3 pad 0.61)
  Top 0.254: v26.88,28.44 26.54,28.44 24.74,30.23 24.74,31.11 R4.2
  Bottom 0.254: IC31.7 33.75,24.89 33.44,24.89 31.03,27.3 Y2.P$2 C14.2 26.93,28.18 26.88,28.24 v26.88,28.44
N$4
  Bottom 0.254: IC4.2 43.41,17.16 45.4,15.18 C4.2
N$5  (via drill 0.3 pad 0.61)
  Top 0.254: v49.53,28.11 52.51,28.11 52.88,27.73 55.97,27.73 56.35,27.35 56.35,27.25 J3.3
  Bottom 0.254: IC4.15 49.53,25.47 v49.53,28.11
N$6  (via drill 0.3 pad 0.61)
  Top 0.254: J3.4 56.35,26.45 56.35,26.35 55.96,25.96 52.27,25.96 52.01,26.23 v51.88,26.23
  Bottom 0.254: v51.88,26.23 49.96,24.31 IC4.16
N$7  (via drill 0.3 pad 0.61)
  Top 0.254: RX.C 59.03,20.95 58.58,20.5 v55.73,20.5
  Bottom 0.254: R9.2 55.22,20.32 55.4,20.5 v55.73,20.5
N$8
  Bottom 0.254: R9.1 53.32,20.32 53.32,16.91 53.16,16.75 51.62,16.75 51.03,17.34 51.03,18.59 49.86,19.76 IC4.23
N$9  (via drill 0.3 pad 0.61)
  Top 0.254: TX.C v57.16,19.05
  Bottom 0.254: v57.16,19.05 56.49,19.05 55.22,17.78 R10.2
N$19  (via drill 0.3 pad 0.61)
  Top 0.254: v31.44,28.33 28.99,28.33 26.64,30.68 26.64,31.11 R4.1
  Bottom 0.254: v31.44,28.33 32.47,27.3 Y2.P$1 | Y2.P$1 C15.2 | IC31.8 34.55,24.89 34.53,24.89 33.6,25.83 Y2.P$1
RESET  (via drill 0.3 pad 0.61)
  Top 0.254: v43.44,16.31 35.16,16.31 33.73,17.74 33.73,18.5 32.57,19.66 26.3,19.66 | 26.3,19.66 26.3,14.97 25.21,13.89 25.21,13.65 RESET.2 | 26.3,19.66 26.3,19.74 v26.21,19.83
  Bottom 0.254: v43.44,16.31 43.44,13.79 43.5,13.73 C4.1 R34.2 | 26.54,20.09 26.46,20.09 v26.21,19.83 | 26.54,20.09 26.54,20.47 23.11,23.9 20.5,23.9 19.46,22.86 SV1.7 | IC31.29 26.54,20.09
RX  (via drill 0.3 pad 0.61)
  Top 0.254: RS485.1 32.31,7.11 32.31,7.65 29.58,10.38 27.36,10.38 v27.16,10.58
  Bottom 0.254: RX_SEL.2 25.4,11.15 26.59,11.15 v27.16,10.58
RX0  (via drill 0.3 pad 0.61)
  Top 0.254: v30.98,10.96 31.56,11.53 34.55,11.53 v37.14,14.12
  Bottom 0.254: R12.1 35.54,12.7 35.54,13.53 36.13,14.12 v37.14,14.12 | 27.1,14.42 27.1,14.34 30.48,10.96 v30.98,10.96 | 27.1,14.42 27.1,15.22 28.37,16.49 28.37,20.89 IC31.30 26.7,20.89 22.19,25.4 22,25.4 SV1.6 | 27.1,14.42 25.74,14.42 24.38,13.06 24.38,12.98 RX_SEL.1
RX232
  Bottom 0.254: R12.2 37.44,12.7 37.67,12.46 38.17,12.46 41.91,16.21 IC4.1
TX  (via drill 0.3 pad 0.61)
  Top 0.254: RS485.4 32.31,10.92 32.28,10.95 v31.96,10.95
  Bottom 0.254: TX_SEL.2 31.75,11.15 31.76,11.15 v31.96,10.95
TX1  (via drill 0.3 pad 0.61)
  Top 0.254: v28.21,15.41 v29.3,16.5 | R11.1 22.89,26.04 22.48,26.44 20.5,26.44 19.46,25.4 SV1.5
  Bottom 0.254: TX_SEL.1 29.95,12.06 28.21,13.8 v28.21,15.41 | v29.3,16.5 29.3,20.76 28.37,21.68 IC31.31 26.54,21.68 21.78,26.45 20.5,26.45 19.46,25.4 SV1.5
TX232  (via drill 0.3 pad 0.61)
  Top 0.254: R11.2 27.6,26.04 29.22,24.42 32.8,24.42 36.77,20.44 36.77,18.55 37.35,17.97 39.25,17.97 v39.44,17.78
  Bottom 0.254: IC4.5 40.77,19.11 v39.44,17.78
VCC  (via drill 0.3 pad 0.61)
  Top 0.406: 44.54,16.47 44.54,18.14 v44.76,18.36 | v46.72,14.29 44.54,16.47 | 44.54,16.47 43.72,15.64 41.41,15.64 41.25,15.81 37.08,15.81 34.47,13.2 v32.91,13.2 32.91,13.12 32.8,13.01 RFM69W.VCC | U1.3.3V 56.21,22.85 56.21,22.1 55.06,20.95 55.06,20.18 v57.75,17.49 | C32.1 42.86,6.51 42.96,6.41 45.85,6.41 OPT2.4 | v27.62,6.37 27.3,6.69 27.3,7.11 RS485.8 | SV1.3 18.41,26.82 18.25,26.82 15.57,24.14 15.57,21.97 13.91,20.31 12.7,20.31 11.64,19.25 9.67,19.25 v8.88,20.05 | SV1.2 22.07,30.48 22.07,31.33 23.02,32.27 34.4,32.27 OPT.1
  Bottom 0.406: v46.72,14.29 46.82,14.19 46.82,10.57 46.41,10.16 R34.1 R8.2 45.4,6.46 | v44.76,18.36 44.76,23.71 37.99,30.48 OPT.1 | 57.82,17.43 57.82,15.97 52.52,10.67 52.52,8.28 IC3.2 50.3,8.28 50.3,7.21 47.97,4.87 | v57.75,17.49 57.82,17.43 | 57.82,17.43 61.39,20.99 63.12,20.99 64.42,22.29 64.42,27.56 63.86,28.12 JP2.1 | 36.26,5.08 36.26,6.26 36.51,6.51 C10.2 37.52,7.62 38.2,6.93 40.64,6.93 | 36.26,5.08 36.26,4.4 37.49,3.17 37.49,2 36.4,0.91 24.26,0.91 JP1.2 24.26,2.9 25.7,2.9 27.62,4.83 v27.62,6.37 | 36.26,5.08 36.01,5.08 C5.2 | 45.4,6.46 41.11,6.46 40.64,6.93 | SV1.2 19.84,30.48 19.84,30.31 18.58,29.06 18.41,29.06 SV1.3 | C31.1 40.64,6.93 | 47.97,4.87 46.37,6.46 45.4,6.46 | IC1.2 8.64,22.38 8.77,22.24 8.77,20.05 | 8.77,20.05 8.73,20 R6.1 | v8.88,20.05 8.77,20.05 | OPT2.4 48.26,4.58 47.97,4.87 | 32.23,22.38 32.84,22.99 32.95,22.99 IC31.6 | 32.23,16.38 32.23,22.38 | 32.23,22.38 31.62,22.99 31.35,22.99 IC31.4 | 32.23,16.38 32.15,16.38 IC31.20 32.15,13.96 v32.91,13.2 | 32.23,16.38 33.75,16.38 IC31.18
VCC1
  Bottom 0.406: R2.2 23.5,14.55 23.62,14.43 23.62,11.25 IC2.8 27.43,8.89 27.43,7.62 | 28.28,6.35 29.72,6.35 IC2.3 | 28.28,6.35 28.28,4.24 25.95,1.91 JP1.1 | 28.28,6.35 28.28,6.77 27.43,7.62 | IC2.7 27.43,7.62
VIN
  Top 0.406: X1.1 10.98,11.25 J1.2-3 12.21,10.36 12.21,6.34 | F1.P$2 53.59,5.61 54.45,5.61 U$3.TIP | OPT2.2 41.88,5.3 31.01,5.3 29.67,3.96 16.29,3.96 13.91,6.34 12.21,6.34 | 12.21,6.34 | 12.21,24.33 J1.1-3 | J1.1-7 12.21,21.37 12.21,24.33 | 12.21,24.33 13.2,25.33 13.85,25.33 17.89,29.36 18.41,29.36 SV1.1 | 12.21,6.34 J1.2-7
  Bottom 0.406: OPT2.2 45.04,2.14 49.91,2.14 51.72,3.95 U$3.TIP | J1.1-7 11.15,17.2 14.74,13.61 14.74,12.25 13.91,11.42 J1.2-3
VIN-FUSED  (via drill 0.3 pad 0.61)
  Top 0.406: F1.P$1 v47.8,7.62 R1.1
  Bottom 0.406: JP2.3 62.87,25.43 60.79,23.36 60.55,23.36 59.67,22.48 59.67,20.34 54.18,14.86 54.18,13.34 IC3.3 48.02,8.28 48.02,7.84 v47.8,7.62
VUSB  (via drill 0.3 pad 0.61)
  Top 0.406: v62.31,23.42 62.31,22.21 62.01,21.91 RX.A TX.A
  Bottom 0.406: V_SEL.1 44.65,28.93 47.09,28.93 | 47.09,28.93 47.09,22.7 48.07,21.71 IC4.20 | 47.09,28.93 47.99,29.83 53.52,29.83 54.22,29.14 54.22,28.57 C2.1 | v62.31,23.42 63.86,24.97 63.86,27.3 JP2.2 58.66,27.3 58.42,27.55 F2.1 56.66,28.7 56.53,28.57 55.95,28.57 C2.1 | C2.1 55.38,27.32 55.56,27.14 C1.1
VUSB_PREFUSE
  Bottom 0.406: F2.2 58.42,24.75 58.17,24.5 D1.C
VUSB_RAW  (via drill 0.3 pad 0.61)
  Top 0.406: J3.5 59.53,25.65 59.53,24 v60.83,22.7
  Bottom 0.406: D1.A 61.48,22.23 61.01,22.7 v60.83,22.7
(copper drawn outside any net)
  shapes: Top area x1

### Text on the board
tNames: SDA | SCL | GND | VCC | USB | R4 | R11 | GND | RX | TX | B | ANT | A | VIN | C32 | R1 | Reset | StepDown | GND | RS485 | Fuse1 | MysX2.6 | nanoGW_RJ45 V1.0 | VIN | D9 | D8 | D7 | D4
bNames: A4 | A5 | GND | VCC | USB-POWER SELECT | Voltage Select | LOOP-B | LOOP-A | 5V | 3V3 | FUSE | C14 | C15 | C2 | 2VCC | C1 | 2REG | Crystal | FT232RL | ATSHA | C6 | R9 | D1 | R6 | R10 | ATMEGA328P | R2 | R5 | RX0 | D8 | TX1 | D9 | C4 | R12 | REG1117 | C31 | R34 | RX_Select | TX_Select | R3 | R7 | R8 | C10 | EEPROM | C5 | V-EEPROM
Name: I2C-CON | A2 | A1